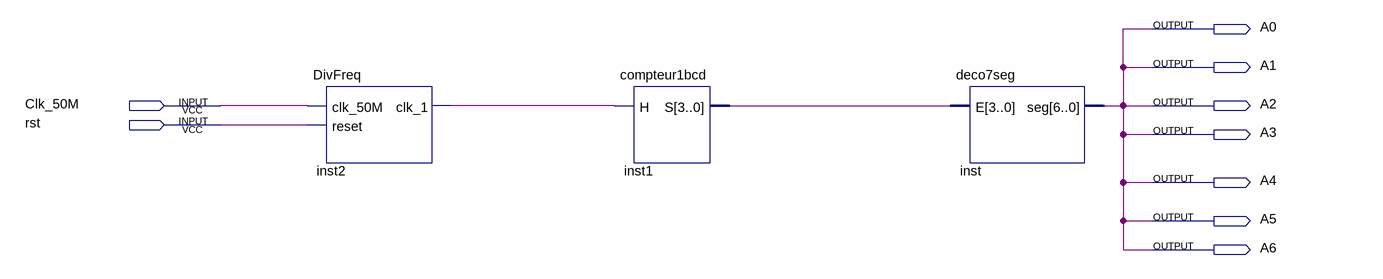
[diagram p0: schematic sheet]
// Quartus schematic composant.bdf as structural Verilog: 3 symbols, 9 pins
module composant (
  input  Clk_50M,
  input  rst,
  output A0,
  output A1,
  output A2,
  output A3,
  output A4,
  output A5,
  output A6
);

  wire inst2_clk_1;
  wire [3:0] inst1_s;

  DivFreq inst2 (.clk_50M(Clk_50M), .reset(rst), .clk_1(inst2_clk_1));
  compteur1bcd inst1 (.H(inst2_clk_1), .S(inst1_s));
  deco7seg inst (.E(inst1_s), .seg(A0));

  assign A1 = A0;
  assign A2 = A0;
  assign A3 = A0;
  assign A4 = A0;
  assign A5 = A0;
  assign A6 = A0;
endmodule
